# Altium project TS.PrjPcb
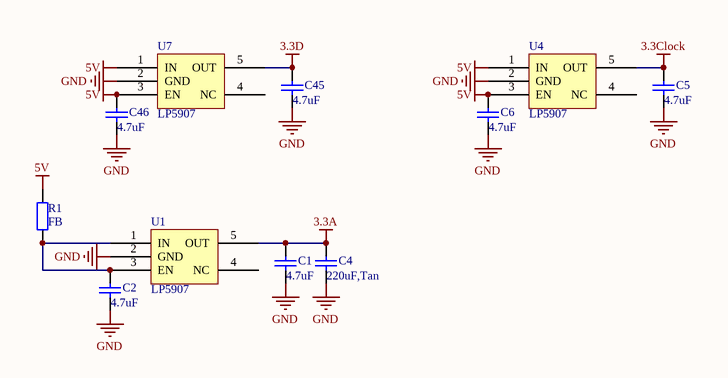
[diagram p0: power.SchDoc]
3 sheets, 75 parts. Net scope: flat (ports and power ports of the same name join across sheets).
Board file: TS.PcbDoc
Sheets:
  power.SchDoc
  MCU.SchDoc
  audio.SchDoc

## Sheet power.SchDoc
size A4

### Parts
C1  4.7uF  [0603L]
C2  4.7uF  [0603L]
C4  220uF,Tan  [1210]
C5  4.7uF  [0603L]
C6  4.7uF  [0603L]
C45  4.7uF  [0603L]
C46  4.7uF  [0603L]
R1  FB  [0603L]
U1  LP5907  [SOT23-5]
U4  LP5907  [SOT23-5]
U7  LP5907  [SOT23-5]

### Nets
3.3A: C1.2 C4.2 U1.5(OUT)
3.3Clock: C5.2 U4.5(OUT)
3.3D: C45.2 U7.5(OUT)
5V: C6.2 C46.2 R1.2 U4.1(IN) U4.3(EN) U7.1(IN) U7.3(EN)
GND: C1.1 C2.1 C4.1 C5.1 C6.1 C45.1 C46.1 U1.2(GND) U4.2(GND) U7.2(GND)
NetC2_2: C2.2 R1.1 U1.1(IN) U1.3(EN)

Not connected (* = marked no-connect by the designer): U1 4(NC); U4 4(NC); U7 4(NC)

### Library data of the parts
C1 C2 C4-C6 C45 C46 = Cap: Capacitor; Published: 8-Jun-2000; LatestRevisionDate: 17-Jul-2002; LatestRevisionNote: Re-released for DXP Platform.; PackageReference: RAD-0.3; Publisher: Altium Limited; PackageDescription: Radial Cap, Thru-Hole; 2 Leads; 0.3 in Pin Spacing
R1 = Res2: Resistor; Value: 0Ohm; Published: 8-Jun-2000; LatestRevisionDate: 17-Jul-2002; LatestRevisionNote: Re-released for DXP Platform.; PackageReference: AXIAL-0.4; Publisher: Altium Limited; PackageDescription: Axial Device, Thru-Hole; 2 Leads; 0.4 in Pin Spacing

## Sheet MCU.SchDoc
size A4
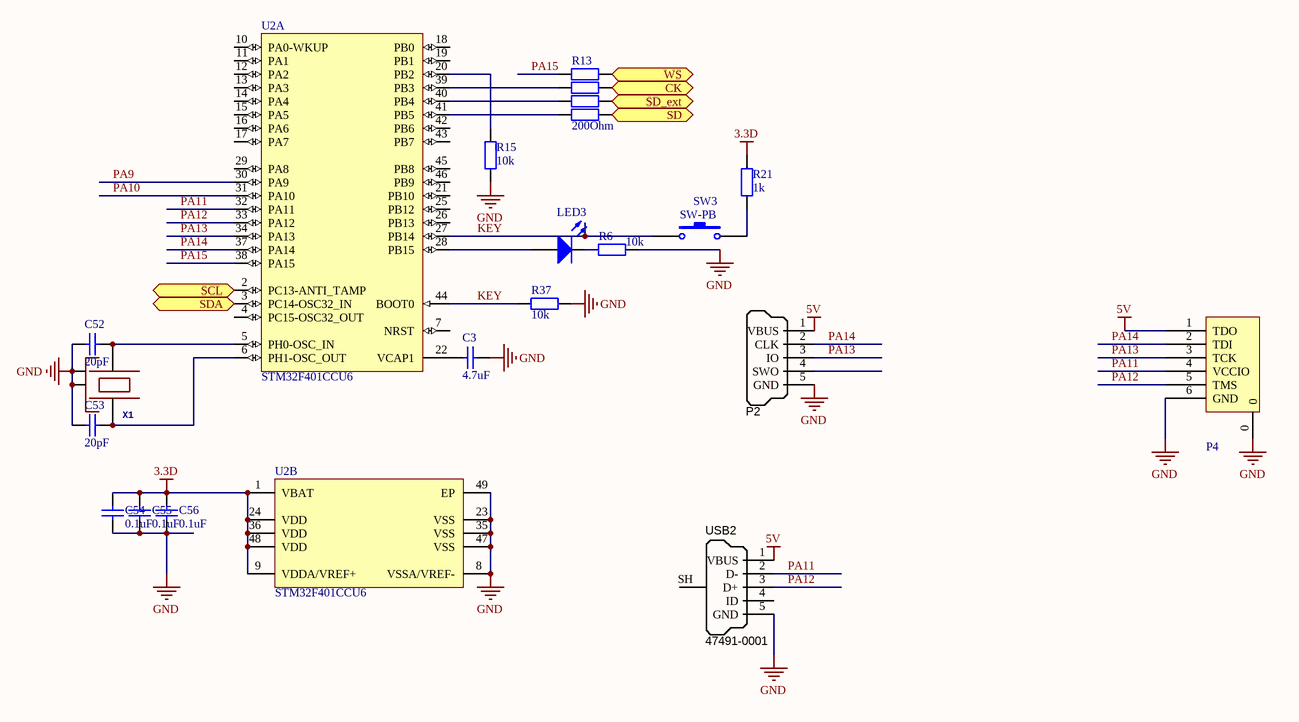
[diagram p1: MCU.SchDoc]

### Parts
C3  value 4.7uF  [0603L]  (hidden comment: Cap)
C52  value 20pF  [0402]  (hidden comment: Cap)
C53  value 20pF  [0402]  (hidden comment: Cap)
C54  value 0.1uF  [0402]  (hidden comment: Cap)
C55  value 0.1uF  [0402]  (hidden comment: Cap)
C56  value 0.1uF  [0402]  (hidden comment: Cap)
LED3  LED0  [0603]  (value not drawn)
P2  SWD_MicroUSB  [MICRO-YZX]  (value not drawn)
P4  JTAG-6P  [GH1.25-6]  (value not drawn)
R6  10k  [0402]
R13  value 200Ohm  [0402X4]  (hidden comment: Res*4)
R15  10k  [0402]
R21  1k  [0402]
R37  value 10k  [0402]  (hidden comment: Res2)
SW3  SW-PB  [SW3x4]
U2  STM32F401CCU6  [STM-UFQFPN48_N]  (parts A,B of 2)
USB2  Manufacturer Part Number 1: 47491-0001  [MICRO-YZX]  (hidden comment: USB Micro Type B)
X1  24.000 KHz 3.2x2.5mm 8-10pf  [OSCILLATOR-2.5x2.0]  (value not drawn)

### Ports
CK, SCL, SD, SD_ext, SDA, WS

### Nets
3.3D: C54.2 C55.2 C56.2 R21.2 U2.1(VBAT) U2.9(VDDA/VREF+) U2.24(VDD) U2.36(VDD) U2.48(VDD)
5V: P2.1(VBUS) P4.1(TDO) USB2.1(VBUS)
GND: C3.1 C52.1 C53.1 C54.1 C55.1 C56.1 P2.5(GND) P4.0 P4.6(GND) R6.2 R15.2 R37.2 U2.8(VSSA/VREF-) U2.23(VSS) U2.35(VSS) U2.47(VSS) U2.49(EP) USB2.5(GND) X1.2(NC_2) X1.4(NC_4)
KEY: R37.1 SW3.1 U2.27(PB14) U2.44(BOOT0)
PA9: U2.30(PA9)
PA10: U2.31(PA10)
PA11: P4.4(VCCIO) U2.32(PA11) USB2.2(D-)
PA12: P4.5(TMS) U2.33(PA12) USB2.3(D+)
PA13: P2.3(IO) P4.3(TCK) U2.34(PA13)
PA14: P2.2(CLK) P4.2(TDI) U2.37(PA14)
PA15: R13.8 U2.38(PA15)
NetC3_2: C3.2 U2.22(VCAP1)
NetC52_2: C52.2 U2.5(PH0-OSC_IN) X1.1
NetC53_2: C53.2 U2.6(PH1-OSC_OUT) X1.3
NetLED3_1: LED3.1(A) U2.28(PB15)
NetLED3_2: LED3.2(K) R6.1
NetR2_1: U2.2(PC13-ANTI_TAMP) ; port SCL
NetR3_1: U2.3(PC14-OSC32_IN) ; port SDA
NetR13_1: R13.1 ; port WS
NetR13_2: R13.2 ; port CK
NetR13_3: R13.3 ; port SD_ext
NetR13_4: R13.4 ; port SD
NetR13_5: R13.5 U2.41(PB5)
NetR13_6: R13.6 U2.40(PB4)
NetR13_7: R13.7 U2.39(PB3)
NetR15_1: R15.1 U2.20(PB2)
NetR21_1: R21.1 SW3.2

Not connected (* = marked no-connect by the designer): P2 4(SWO); U2 4(PC15-OSC32_OUT) 7(NRST) 10(PA0-WKUP) 11(PA1) 12(PA2) 13(PA3) 14(PA4) 15(PA5) 16(PA6) 17(PA7) 18(PB0) 19(PB1) 21(PB10) 25(PB12) 26(PB13) 29(PA8) 42(PB6) 43(PB7) 45(PB8) 46(PB9); USB2 4(ID) SH(Shell)

### Library data of the parts
C3 C52-C56 = Cap: Capacitor; Published: 8-Jun-2000; LatestRevisionDate: 17-Jul-2002; LatestRevisionNote: Re-released for DXP Platform.; PackageReference: RAD-0.3; Publisher: Altium Limited; PackageDescription: Radial Cap, Thru-Hole; 2 Leads; 0.3 in Pin Spacing
LED3 = LED0: Typical INFRARED GaAs LED; Published: 8-Jun-2000; LatestRevisionDate: 08-Jul-2005; LatestRevisionNote: Mech Layer 1 removed.; PackageReference: LED-0; Publisher: Altium Limited; PackageDescription: LED; 2 Leads
P2 = SWD_MicroUSB: Connector SMD USB Micro Type B middle mount; Manufacturer 1: Molex Inc; SCDType: undef; Package / Case: SMD; Supplier 1: Digi-Key; Supplier Part Number 1: WM17142CT-ND
R6 R15 R21 = Res2: Resistor; Value: 0Ohm; Published: 8-Jun-2000; LatestRevisionDate: 17-Jul-2002; LatestRevisionNote: Re-released for DXP Platform.; PackageReference: AXIAL-0.4; Publisher: Altium Limited; PackageDescription: Axial Device, Thru-Hole; 2 Leads; 0.4 in Pin Spacing
R13 = Res*4: Resistor; Published: 8-Jun-2000; LatestRevisionDate: 17-Jul-2002; LatestRevisionNote: Re-released for DXP Platform.; PackageReference: AXIAL-0.4; Publisher: Altium Limited; PackageDescription: Axial Device, Thru-Hole; 2 Leads; 0.4 in Pin Spacing
R37 = Res2: Resistor; Published: 8-Jun-2000; LatestRevisionDate: 17-Jul-2002; LatestRevisionNote: Re-released for DXP Platform.; PackageReference: AXIAL-0.4; Publisher: Altium Limited; PackageDescription: Axial Device, Thru-Hole; 2 Leads; 0.4 in Pin Spacing
SW3 = SW-PB: Switch; Published: 24-Mar-1999; LatestRevisionDate: 17-Jul-2002; LatestRevisionNote: Re-released for DXP Platform.; PackageReference: SPST-2; Publisher: Altium Limited; PackageDescription: Switch; 2 Leads
U2 = STM32F401CCU6: ARM Cortex-M4 32-bit MCU+FPU, 105 DMIPS, 256 kB Flash, 64 kB Internal RAM, 36 I/Os, 48-pin UFQFPN, -40 to 85 degC, Tray; Manufacturer: STMicroelectronics; FLASH Size (Prog) (kB): 256; I/Os (High Current): 36; Internal RAM Size (kB): 64; Operating Frequency(F) (Processor speed) (MHz): 84; Supply Voltage(Vcc) max (V): 3.6; Supply Voltage(Vcc) min (V): 1.8; DatasheetVersion: Rev. 1; PackageVersion: Rev. 1, 04/2013; PackageReference: UFQFPN48; PackageDescription: 48-Pin Ultra Thin Fine Pitch Quad Flat No-Lead, 7 x 7 x 0.6 mm Body, 0.5 mm Pitch, Exposed Pad; Supplier 1: Newark; Supplier Part Number 1: 19X6217; Supplier 2: Mouser; Supplier Part Number 2: 511-STM32F401CCU6; Core: ARM Cortex-M4; Packing: Tray; Mounting Technology: Surface Mount; PartNumber: STM32F401CCU6; ComponentLink1Description: Manufacturer URL; ComponentLink1URL: http://www.st.com/web/en/home.html; ComponentLink2Description: Datasheet; ComponentLink2URL: http://www.st.com/st-web-ui/static/active/en/resource/technical/document/data_brief/DM00071938.pdf; ComponentLink3Description: Package Specification; ComponentLink3URL: http://www.st.com/st-web-ui/static/active/en/resource/technical/document/data_brief/DM00071938.pdf
USB2 = USB_Micro_TypeB: Connector SMD USB Micro Type B middle mount; Manufacturer 1: Molex Inc; SCDType: undef; Package / Case: SMD; Supplier 1: Digi-Key; Supplier Part Number 1: WM17142CT-ND
X1 = OSCILLATOR-3.2X2.5: Crystal Oscillator in 3.2x2.5 SMD

## Sheet audio.SchDoc
size A4
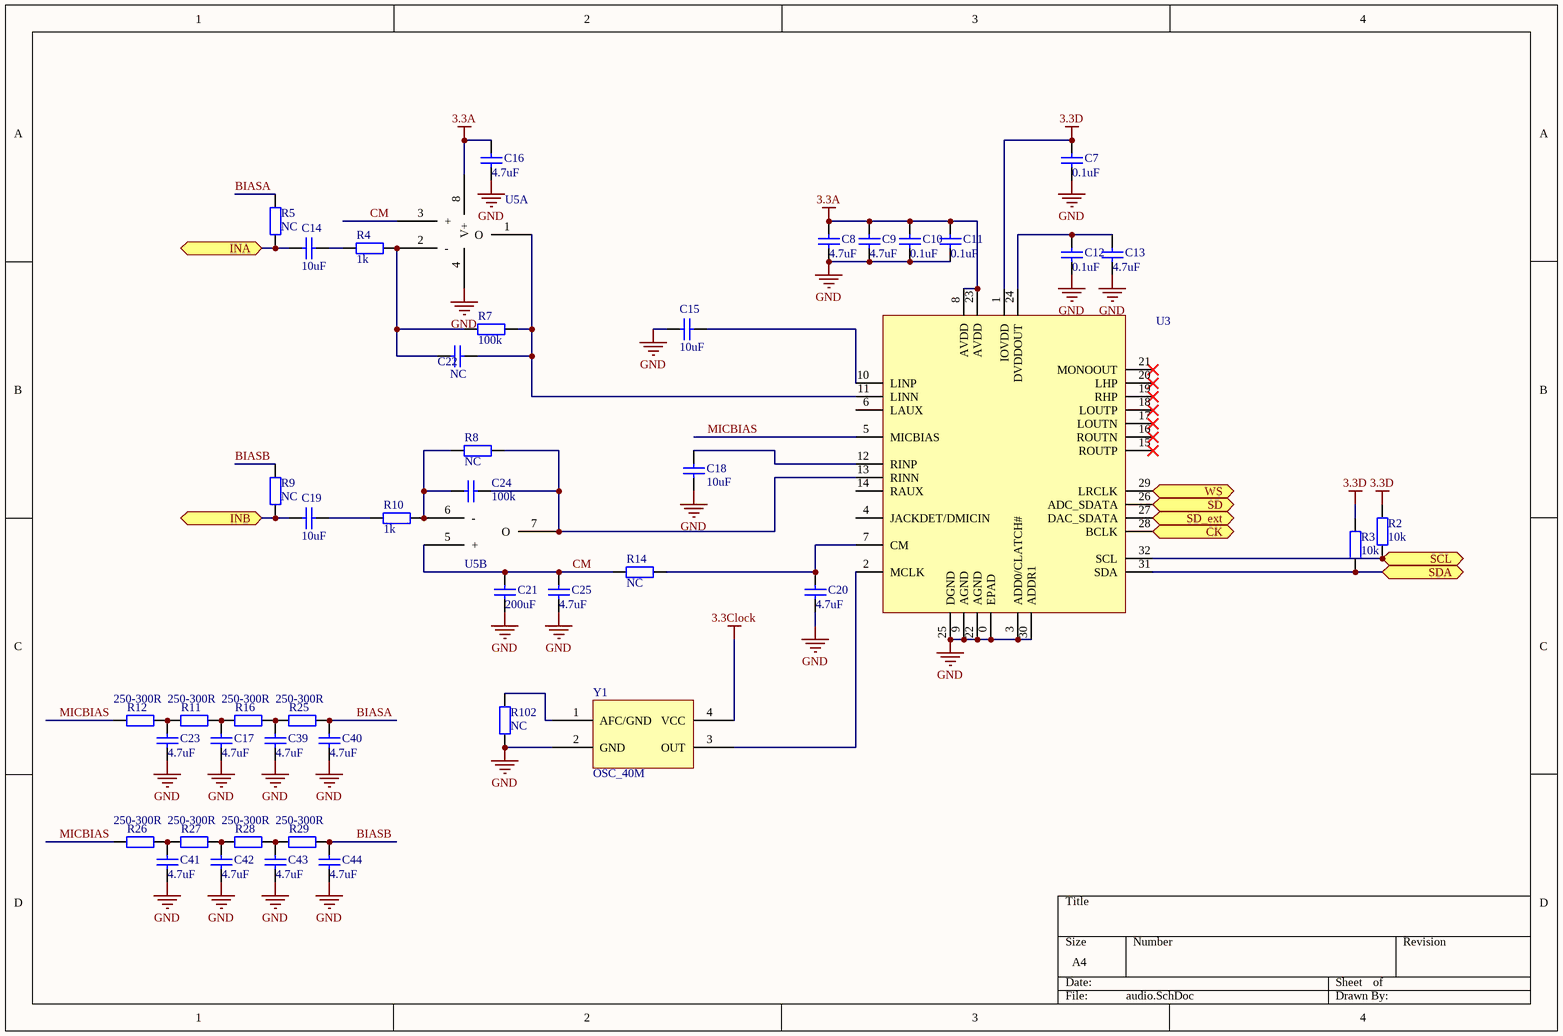
[diagram p2: audio.SchDoc]

### Parts
C7  0.1uF  [0402]
C8  4.7uF  [0805]
C9  4.7uF  [0805]
C10  0.1uF  [0402]
C11  0.1uF  [0402]
C12  0.1uF  [0402]
C13  4.7uF  [0805]
C14  10uF  [CL21-5mm-1F]
C15  10uF  [0805]
C16  4.7uF  [0805]
C17  4.7uF  [0805]
C18  10uF  [0805]
C19  10uF  [CL21-5mm-1F]
C20  4.7uF  [0805]
C21  200uF  [1210]
C22  NC  [0402]
C23  4.7uF  [0805]
C24  100k  [0402]
C25  4.7uF  [0805]
C39  4.7uF  [0805]
C40  4.7uF  [0805]
C41  4.7uF  [0805]
C42  4.7uF  [0805]
C43  4.7uF  [0805]
C44  4.7uF  [0805]
R2  value 10k  [0402]  (hidden comment: Res2)
R3  value 10k  [0402]  (hidden comment: Res2)
R4  1k  [0402]
R5  NC  [0402]
R7  100k  [0402]
R8  NC  [0402]
R9  NC  [0402]
R10  1k  [0402]
R11  250-300R  [0402]
R12  250-300R  [0402]
R14  NC  [0402]
R16  250-300R  [0402]
R25  250-300R  [0402]
R26  250-300R  [0402]
R27  250-300R  [0402]
R28  250-300R  [0402]
R29  250-300R  [0402]
R102  NC  [0402]
U3  ADAU1761  [ADAU1761]  (value not drawn)
U5  OP-2  [SO8]  (value not drawn)  (parts A,B of 2)
Y1  OSC_40M  [TXC_7Q]

### Ports
CK, INA, INB, SCL, SD, SD_ext, SDA, WS

### Nets
3.3A: C8.2 C9.2 C10.2 C11.2 C16.2 U3.8(AVDD) U3.23(AVDD) U5.8(V+)
3.3Clock: Y1.4(VCC)
3.3D: C7.2 R2.2 R3.2 U3.1(IOVDD)
GND: C7.1 C8.1 C9.1 C10.1 C11.1 C12.1 C13.1 C15.2 C16.1 C17.1 C18.1 C20.1 C21.1 C23.1 C25.1 C39.1 C40.1 C41.1 C42.1 C43.1 C44.1 R102.2 U3.0(EPAD) U3.3(ADD0/CLATCH#) U3.9(AGND) U3.22(AGND) U3.25(DGND) U3.30(ADDR1) U5.4 Y1.2(GND)
BIASA: C40.2 R5.2 R25.1
BIASB: C44.2 R9.2 R29.1
CM: C21.2 C25.2 R14.2 U5.3(+) U5.5(+)
MICBIAS: R12.2 R26.2 U3.5(MICBIAS)
NetC12_2: C12.2 C13.2 U3.24(DVDDOUT)
NetC14_1: C14.1 R4.1
NetC14_2: C14.2 R5.1 ; port INA
NetC15_1: C15.1 U3.10(LINP)
NetC17_2: C17.2 R11.1 R16.2
NetC18_2: C18.2 U3.12(RINP)
NetC19_1: C19.1 R10.1
NetC19_2: C19.2 R9.1 ; port INB
NetC20_2: C20.2 R14.1 U3.7(CM)
NetC22_1: C22.1 R7.2 U3.11(LINN) U5.1(O)
NetC22_2: C22.2 R4.2 R7.1 U5.2(-)
NetC23_2: C23.2 R11.2 R12.1
NetC24_1: C24.1 R8.2 U3.13(RINN) U5.7(O)
NetC24_2: C24.2 R8.1 R10.2 U5.6(-)
NetC39_2: C39.2 R16.1 R25.2
NetC41_2: C41.2 R26.1 R27.2
NetC42_2: C42.2 R27.1 R28.2
NetC43_2: C43.2 R28.1 R29.2
NetR2_1: R2.1 U3.32(SCL) ; port SCL
NetR3_1: R3.1 U3.31(SDA) ; port SDA
NetR13_1: U3.29(LRCLK) ; port WS
NetR13_2: U3.28(BCLK) ; port CK
NetR13_3: U3.27(DAC_SDATA) ; port SD_ext
NetR13_4: U3.26(ADC_SDATA) ; port SD
NetR102_1: R102.1 Y1.1(AFC/GND)
NetU3_2: U3.2(MCLK) Y1.3(OUT)

Not connected (* = marked no-connect by the designer): U3 4(JACKDET/DMICIN) 6(LAUX) 14(RAUX) 15(ROUTP)* 16(ROUTN)* 17(LOUTN)* 18(LOUTP)* 19(RHP)* 20(LHP)* 21(MONOOUT)*

### Library data of the parts
C7-C25 C39-C44 = Cap: Capacitor; Published: 8-Jun-2000; LatestRevisionDate: 17-Jul-2002; LatestRevisionNote: Re-released for DXP Platform.; PackageReference: RAD-0.3; Publisher: Altium Limited; PackageDescription: Radial Cap, Thru-Hole; 2 Leads; 0.3 in Pin Spacing
R2-R5 R7-R12 R14 R16 R25-R29 R102 = Res2: Resistor; Published: 8-Jun-2000; LatestRevisionDate: 17-Jul-2002; LatestRevisionNote: Re-released for DXP Platform.; PackageReference: AXIAL-0.4; Publisher: Altium Limited; PackageDescription: Axial Device, Thru-Hole; 2 Leads; 0.4 in Pin Spacing

## Nets that join several sheets
3.3A: power (C1.2 C4.2 U1.5), audio (8 pins)
3.3Clock: power (C5.2 U4.5), audio (Y1.4)
3.3D: power (C45.2 U7.5), MCU (9 pins), audio (C7.2 R2.2 R3.2 U3.1)
5V: power (7 pins), MCU (P2.1 P4.1 USB2.1)
GND: power (10 pins), MCU (20 pins), audio (30 pins)
NetR2_1: MCU (U2.2), audio (R2.1 U3.32)
NetR3_1: MCU (U2.3), audio (R3.1 U3.31)
NetR13_1: MCU (R13.1), audio (U3.29)
NetR13_2: MCU (R13.2), audio (U3.28)
NetR13_3: MCU (R13.3), audio (U3.27)
NetR13_4: MCU (R13.4), audio (U3.26)